# Altium schematic sheet Sheet1.SchDoc
size A; SheetNumber: 1; SheetTotal: 1; SPICEModelCacheFTARRELZ: <root> / <DocumentId>FTARRELZ</DocumentId> / </root>
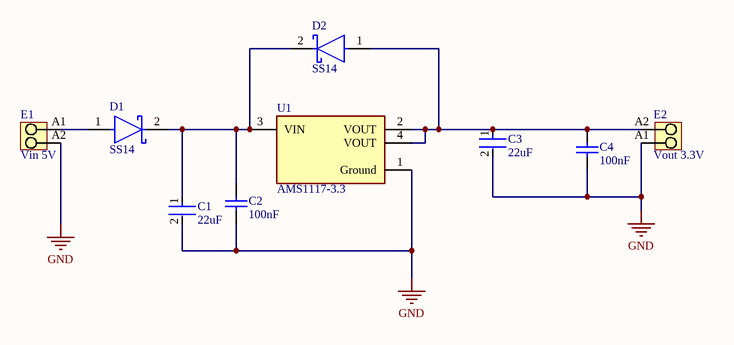
[diagram p0: Sheet1.SchDoc]

## Parts
C1  22uF  [FP-C3225-250-0_4-IPC_C]
C2  100nF  [CAPC0805(2012)100_N]
C3  22uF  [FP-C3225-250-0_4-IPC_C]
C4  100nF  [CAPC0805(2012)100_N]
D1  SS14  [FP-403AE-MFG]
D2  SS14  [FP-403AE-MFG]
E1  Vin 5V  [LPP_5_08_90_02]
E2  Vout 3.3V  [LPP_5_08_90_02]
U1  AMS1117-3.3  [FP-AMS1117-IPC_A]

## Nets
GND: C1.2 C2.1 C3.2 C4.1 E1.A2 E2.A1 U1.1(Ground)
NetC1_1: C1.1 C2.2 D1.2(C) D2.2(C) U1.3(VIN)
NetC3_1: C3.1 C4.2 D2.1(A) E2.A2 U1.2(VOUT) U1.4(VOUT)
NetD1_1: D1.1(A) E1.A1

## Library data of the parts
C1 C3 = CMP-08246-001769-2: Multilayer Ceramic Capacitors 22uF ±20% 25V X7R SMD 1210; RoHS Compliant: Yes
C2 C4 = CMP-1036-04418-1: CAP 100nF 50V ±5% 0805 (2012 Metric) Thickness 1mm SMD; Case-EIA: 0805; Tolerance: Â±5%; Case-Metric: 2012; Max Thickness: 1 mm; Technology: SMT; Value: 100nF; Rated Voltage: 50 V
D1 D2 = CMP-2000-04943-2: DIODE SCHOTTKY 40V 1A SMA; Manufacturer: ON Semiconductor; Peak Reverse Current: 0.2mA; Max Junction Temp: +125°C; Standoff Height: 0.05mm; Max Surge Forward Current: 40A; Mouser Description: Schottky Diodes & Rectifiers SMA 40V 1.0A; RoHS: TRUE; Lead Free: Yes; Manufacturer Part Number: SS14; Device Class L3: Schottky Diodes; Category: Diode; Automotive: No; Digikey Description: DIODE SCHOTTKY 40V 1A SMA; ComponentLink2Description: Datasheet; Device Class L2: Diodes; Height: 2.5mm; Temperature Range High: +125°C; ComponentLink2URL: https://www.onsemi.com/pub/Collateral/SS19-D.PDF; Device Class L1: Discrete Semiconductors; Package: 403AE; Octopart: https://octopart.com/ss14-on+semiconductor-29205033; Max Repetitive Reverse Voltage: 40V; Temperature Range Low: -65°C; Forward Current: 1A; Temperature: -65°C to +125°C
E1 E2 = CMP-1559-02057-1: OMNIMATE Signal - series LP; PartNumber: 1594400000; Manufacturer: Weidmueller; Pitch_inch: 0,2 inch; No_of_poles: 2; Contact_material: Cu-Leg; Wire_cross_section_AWG_max_UL_1059: AWG 12; Contact_surface: tinned; Rated_current_use_group_B_UL_1059: 20 A; Insulating_material: PA; UL_94_flammability_rating: V-2; Rated_voltage_for_surge_voltage_class_pollution_degree_II_2: 500 V; Rated_current_min_no_of_poles_TU_20_deg_C: 32 A; Rated_voltage_use_group_B_UL_1059: 300 V; Pitch_mm: 5,08 mm; Short_text_for_material: LPP 5.08/02/90 3.2SN OR BX; Solid_max_H05_07_V_U: 6 mm²; Wire_cross_section_AWG_min_UL_1059: AWG 26; Side_termination_characteristic: closed side; Mounting_onto_the_PCB: Solder connection; Solder_pin_length_mm: 3,2 mm; Solid_min_H05_07_V_U: 0,5 mm²; ComponentLink1URL: http://www.weidmueller.com/; Colour: Orange; ComponentLink2URL: http://catalog.weidmueller.com/catalog/Start.do?localeId=en&ObjectID=1594400000; Revision: V1; ComponentLink1Description: Manufacturer URL; Qty: 100 PCS; Packaging: Box; PackageReference: LPP_5_08_90_02; ComponentLink2Description: URL Link1
U1 = CMP-209535-000001-1: LDO Voltage Regulators 1A, 3.3V; Manufacturer: Advanced Monolithic Systems; Dropout Voltage: 1.1V; Output Type: Fixed; Nominal Supply Current: 5mA; Max Power Dissipation: 1.2W; Max Supply Voltage: 15V; Number Of Outputs: 1; Standoff Height: 0.64mm; Max Junction Temp: +125°C; Height: 1.8mm; Package: AMS1117; Device Class L2: Power Management ICs; ComponentLink2Description: Datasheet; ComponentLink2URL: http://www.advanced-monolithic.com/pdf/ds1117.pdf; Category: IC; RoHS: TRUE; Automotive: No; Device Class L1: Integrated Circuits (ICs); Output Current: 1A; Device Class L3: Voltage Regulators - Linear; Temperature: -40°C to +125°C; Output Voltage: 3.3V; Manufacturer Part Number: AMS1117-3.3; Temperature Range Low: -40°C; Octopart: https://octopart.com/ams1117-3.3-advanced+monolithic+systems-25899300; Lead Free: Yes; Ipc Land Pattern Name: SOT229P700X180-4; Temperature Range High: +125°C